# EAGLE design adapter (EAGLE 9.5.1)
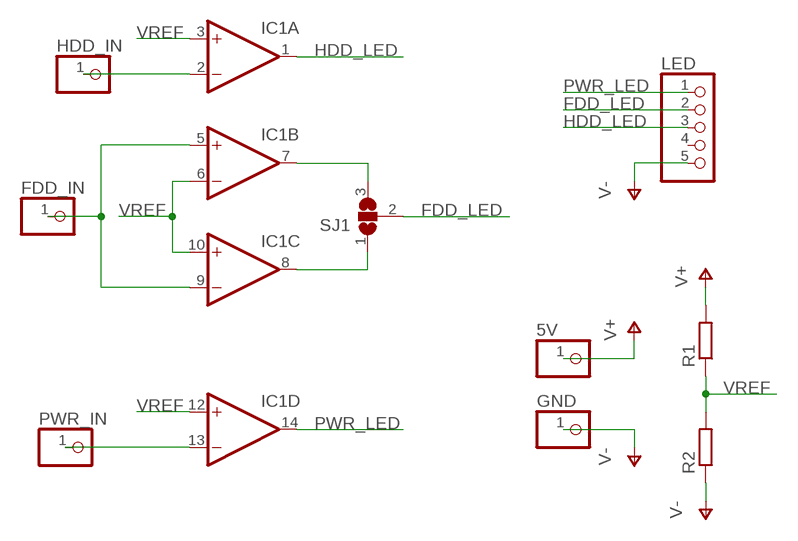
[diagram p0: schematic, sheet 1]

## Parts
5V  PINHD-1X1  [1X01]
FDD_IN  PINHD-1X1  [1X01]
GND  PINHD-1X1  [1X01]
HDD_IN  PINHD-1X1  [1X01]
IC1  OP11D  [SO14]
LED  PINHD-1X5  [1X05]
PWR_IN  PINHD-1X1  [1X01]
R1  R-EU_R0805  [R0805]
R2  R-EU_R0805  [R0805]
SJ1  SJ2W  [SJ_2]

## Nets
FDD_IN: FDD_IN.1 IC1.5(B:+IN) IC1.9(C:-IN)
FDD_LED: LED.2 SJ1.2
HDD_IN: HDD_IN.1 IC1.2(A:-IN)
HDD_LED: IC1.1(A:OUT) LED.3
N$5: IC1.7(B:OUT) SJ1.3
N$7: IC1.8(C:OUT) SJ1.1
PWR_IN: IC1.13(D:-IN) PWR_IN.1
PWR_LED: IC1.14(D:OUT) LED.1
V+: 5V.1 R1.2
V-: GND.1 LED.5 R2.1
VREF: IC1.3(A:+IN) IC1.6(B:-IN) IC1.10(C:+IN) IC1.12(D:+IN) R1.1 R2.2
Unconnected: LED.4

## Power pins joined to a net without a drawn wire
V+: IC1.4(P:V+)
V-: IC1.11(P:V-)

## Library data of the parts
5V FDD_IN GND HDD_IN PWR_IN = pinhead:PINHD-1X1: PIN HEADER
IC1 = linear:OP11: Quad Low-Offset Low-Power OP AMP The OP-11 is pin compatible with the OP-400 , LM148, HA4741, RM4156, and LT1014 operational amplifiers source http://products.analog.com/products/info.asp?product=OP400
LED = pinhead:PINHD-1X5: PIN HEADER
R1 R2 = rcl:R-EU_: RESISTOR, European symbol; SPICEPREFIX: R
SJ1 = jumper:SJ2W: SMD solder JUMPER

## Board
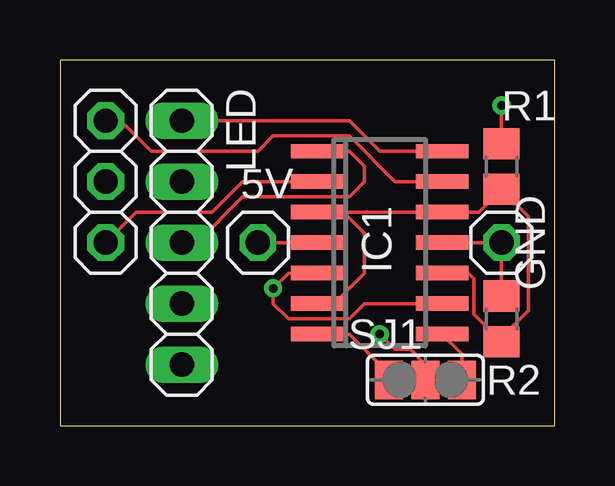
[diagram p1: board, top side]
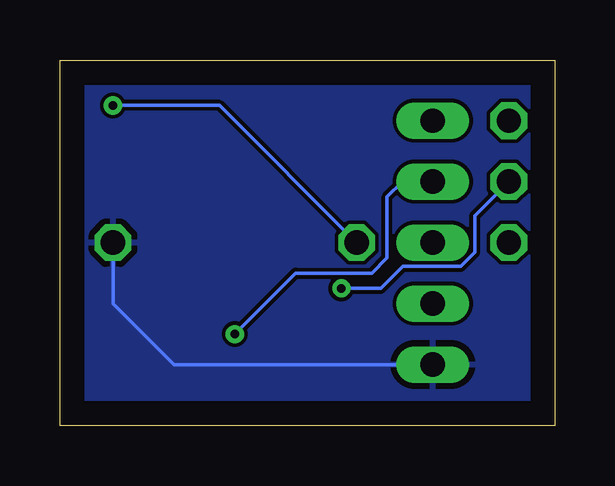
[diagram p2: board, bottom side, seen from below]

Size 20.62 x 15.23 mm. Coordinates in mm from the lower left corner, seen from the top.
Outline: 0,0 20.62,0 20.62,15.23 0,15.23 0,0
Copper layers (1*16): Top 0.035mm / dielectric 1.5mm / Bottom 0.035mm
Design rules "default": minimum track width 6mil, minimum drill 0.35mm, track to track 6mil, track to pad 6mil, pad to pad 6mil, via to via 6mil, smd to smd 6mil, copper to edge 40mil, drill to drill 6mil, minimum pad ring 10mil, minimum via ring 8mil, stop-mask expansion 4mil, vias tented up to drill 0mil, thermal gap 10mil

### Footprints (pad centres in the part's own frame; a part is rotated, then mirrored left to right if it is on the bottom)
1X01 = drill 1.016 octagon: 1 0,0
SO14 = smd 0.6 x 2.2: 1 -3.81,-2.6; 2 -2.54,-2.6; 3 -1.27,-2.6; 4 0,-2.6; 5 1.27,-2.6; 6 2.54,-2.6; 7 3.81,-2.6; 8 3.81,2.6; 9 2.54,2.6; 10 1.27,2.6; 11 0,2.6; 12 -1.27,2.6; 13 -2.54,2.6; 14 -3.81,2.6
1X05 = drill 1.016 long: 1 -5.08,0; 2 -2.54,0; 3 0,0; 4 2.54,0; 5 5.08,0
R0805 = smd 1.3 x 1.5: 1 -0.95,0; 2 0.95,0
SJ_2 = smd 1.168 x 1.6: 1 -1.524,0; 2 0,0; 3 1.524,0

### Placement (x,y rotation side)
5V  8.26,7.62 0 top
FDD_IN  1.91,10.16 0 top
GND  18.41,7.62 0 top
HDD_IN  1.91,7.62 0 top
IC1  13.34,7.62 270 top
LED  5.08,7.62 270 top
PWR_IN  1.91,12.7 0 top
R1  18.41,10.79 90 top
R2  18.41,4.45 270 top
SJ1  15.24,1.91 180 top

### Tracks (layer width: path | path; a pad name or v marks a point on that pad's centre or on a via)
FDD_IN  (via drill 0.35)
  Top 0.152: IC1.9 12.7,5.08 12.06,4.45 9.53,4.45 8.89,5.08 v8.89,5.71 9.53,6.35 IC1.5
  Bottom 0.152: v8.89,5.71 7.24,5.71 6.33,6.63 3.91,6.63 3.33,7.21 3.33,8.74 FDD_IN.1
FDD_LED  (via drill 0.35)
  Top 0.152: SJ1.2 15.24,2.54 14.61,3.17 13.97,3.17 v13.34,3.81
  Bottom 0.152: v13.34,3.81 10.79,6.35 7.62,6.35 6.99,6.99 6.99,9.53 6.35,10.16 LED.2
HDD_IN
  Top 0.152: HDD_IN.1 3.17,8.89 6.35,8.89 7.62,10.16 IC1.2
HDD_LED
  Top 0.152: IC1.1 12.06,11.43 12.7,10.79 12.7,10.16 12.06,9.53 7.62,9.53 5.71,7.62 LED.3
N$5
  Top 0.152: SJ1.3 13.72,2.16 12.06,3.81 IC1.7
N$7
  Top 0.152: SJ1.1 16.76,2.98 IC1.8
PWR_IN
  Top 0.152: IC1.13 13.97,10.16 12.06,12.06 8.89,12.06 8.26,11.43 3.81,11.43 2.54,12.7 PWR_IN.1
PWR_LED
  Top 0.152: IC1.14 13.34,11.43 12.06,12.7 LED.1
V+  (via drill 0.35)
  Top 0.152: IC1.4 5V.1 | R1.2 v18.41,13.34
  Bottom 0.152: 5V.1 13.97,13.34 v18.41,13.34
V-
  Top 0.152: IC1.11 GND.1 R2.1
  Bottom 0.152: LED.5 15.88,2.54 18.41,5.08 GND.1
  pour Bottom: 0,15.24 0,0 20.95,0 20.95,15.24
VREF
  Top 0.152: IC1.10 17.02,6.35 17.26,6.11 17.26,4.65 R2.2 18.41,3.67 19.53,4.79 19.53,8.73 R1.1 17.46,8.89 IC1.12 IC1.3 11.82,8.89 12.7,8.02 12.7,6.99 12.7,6.35 11.43,5.08 IC1.6